# Altium schematic sheet CoG_CPT.SchDoc
size A3; Author: Audran; CompanyName: Goldorak; Address1: Electrolab; Address2: 52 rue Paul Lescop; Address3: 92000 Nanterre; ProjectName: Cartes_2017
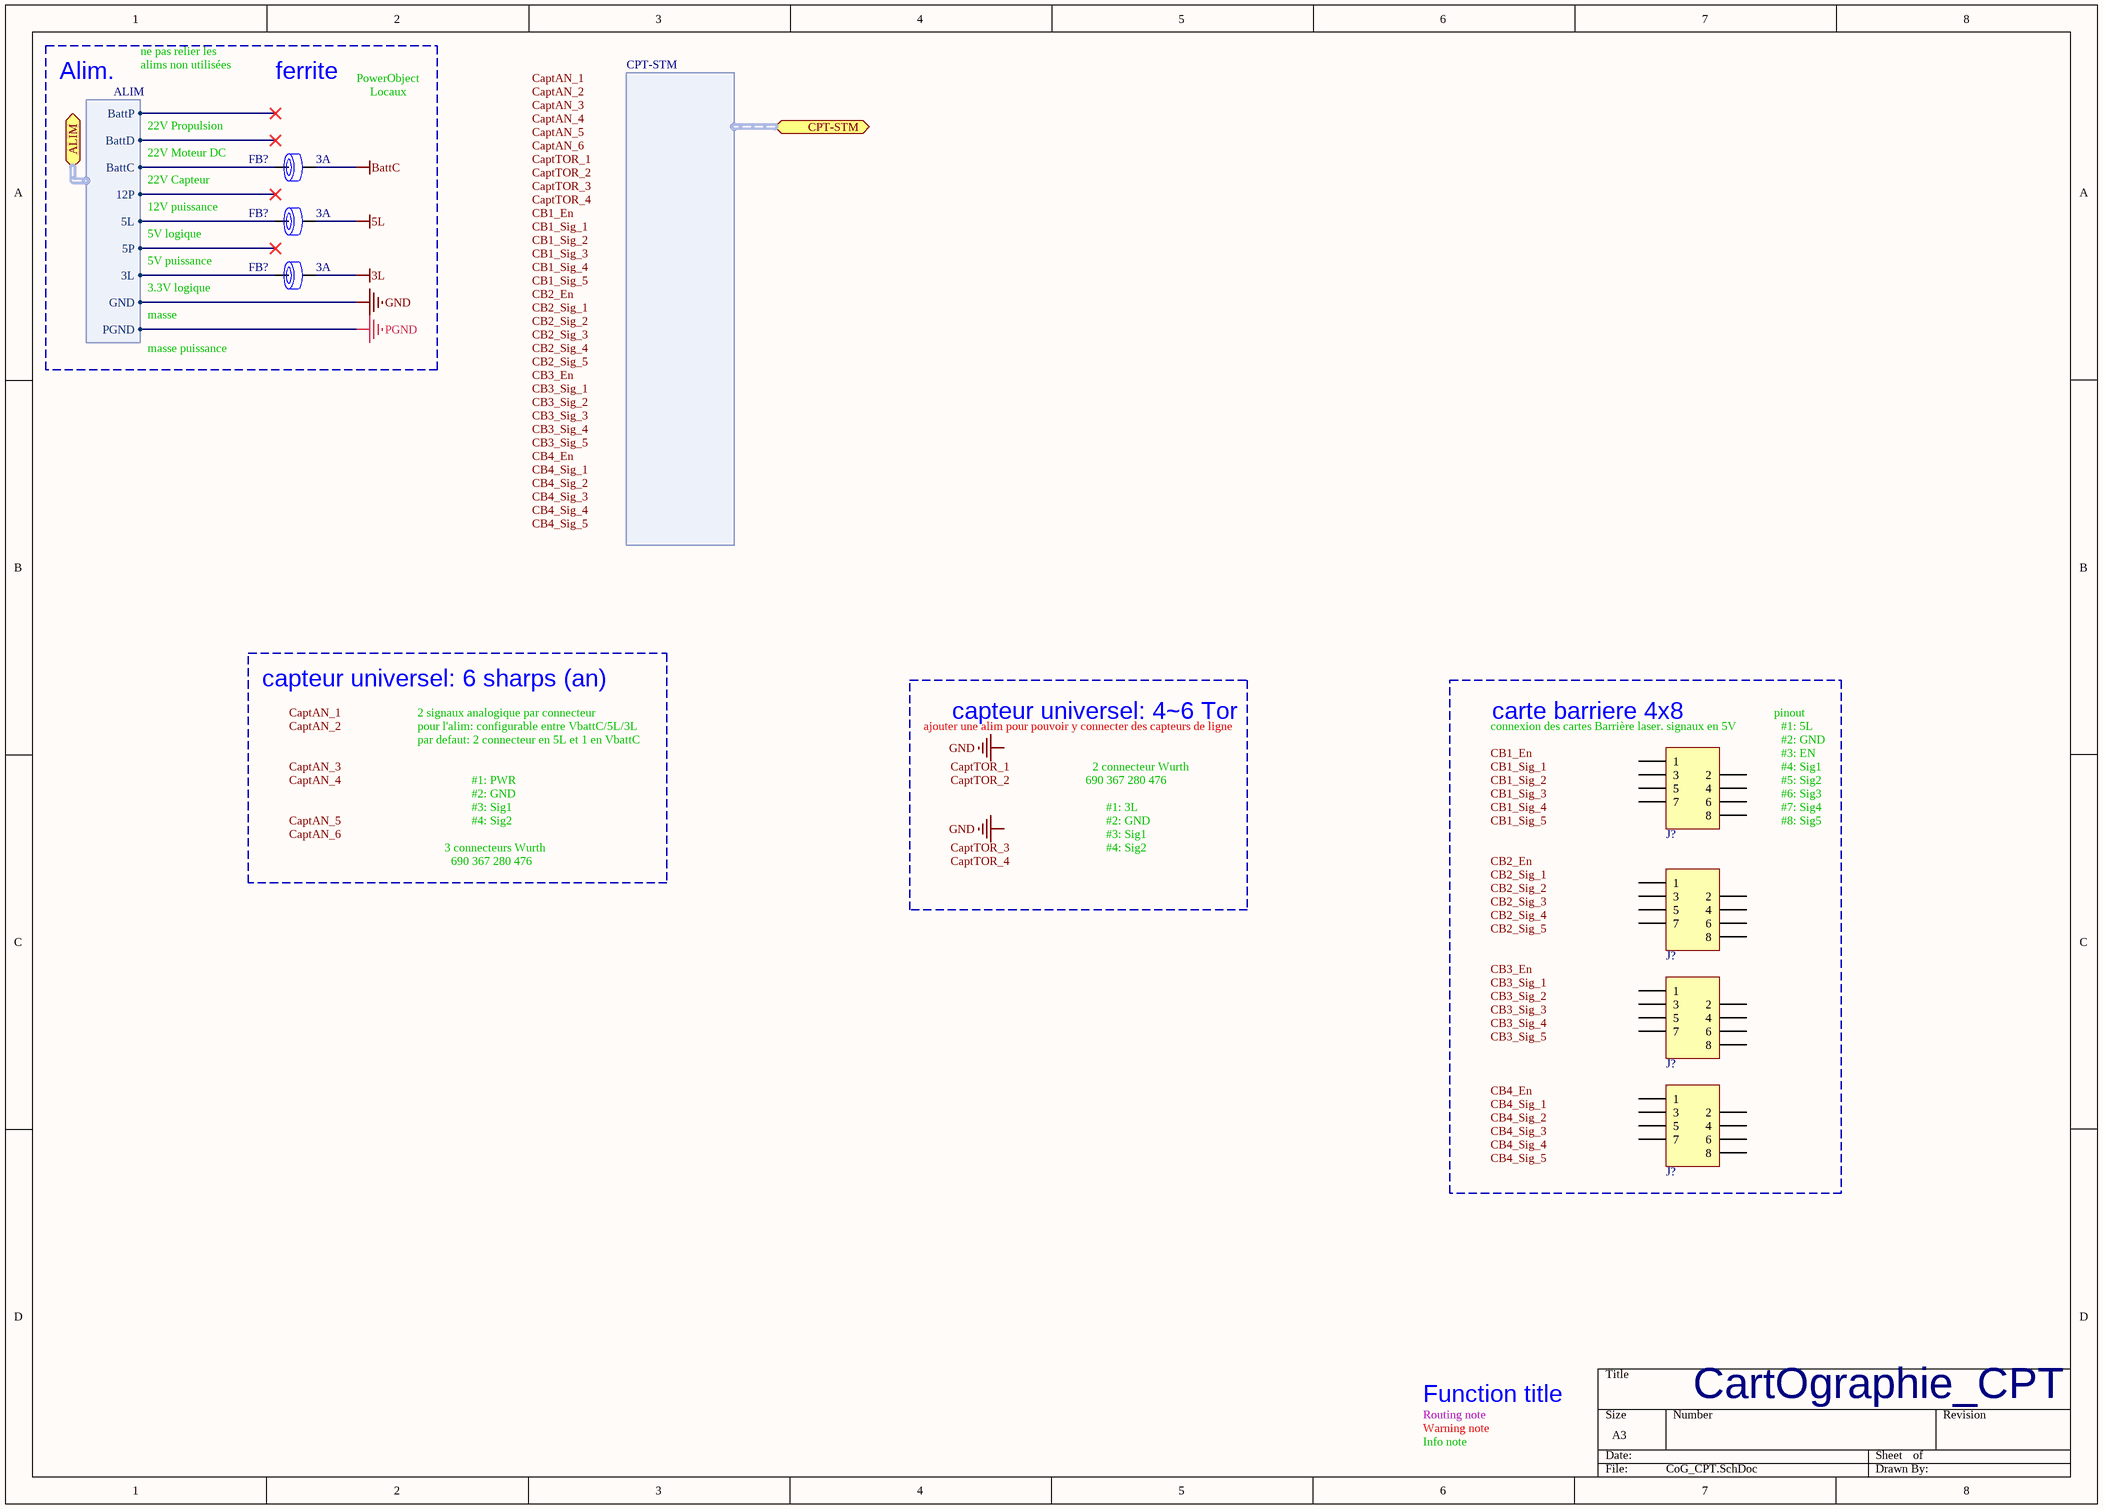
[diagram p0: CoG_CPT.SchDoc]

## Parts
(Parts that share a designator on the sheet are numbered #1, #2 ... from top to bottom, then left to right.)
FB?#1  RatedCurrent: 3A  [WE-CBF_0805_High Current]  (hidden comment: 742792023)
FB?#2  RatedCurrent: 3A  [WE-CBF_0805_High Current]  (hidden comment: 742792023)
FB?#3  RatedCurrent: 3A  [WE-CBF_0805_High Current]  (hidden comment: 742792023)
J?#1  (no value)  [690367280876]
J?#2  (no value)  [690367280876]
J?#3  (no value)  [690367280876]
J?#4  (no value)  [690367280876]

## Blocks framed on the sheet
carte barriere 4x8: J?#1-J?#4

## Ports
ALIM (harness ALIM), CPT-STM (harness CPT-STM)

## Harnesses
CPT-STM: 
ALIM: BattP, BattD, BattC, 12P, 5L, 5P, 3L, GND, PGND

## Nets
3L: FB?#3.2
5L: FB?#2.2
BattC: FB?#1.2
GND: port ALIM.GND
PGND: port ALIM.PGND
NetFB?#1_1: FB?#1.1 ; port ALIM.BattC
NetFB?#2_1: FB?#2.1 ; port ALIM.5L
NetFB?#3_1: FB?#3.1 ; port ALIM.3L

Not connected (* = marked no-connect by the designer): J?#1 1 2 3 4 5 6 7 8; J?#2 1 2 3 4 5 6 7 8; J?#3 1 2 3 4 5 6 7 8; J?#4 1 2 3 4 5 6 7 8

## Notes on the sheet
- Alim.
- ne pas relier les
- alims non utilisées
- ferrite
- PowerObject
- Locaux
- 22V Propulsion
- 22V Moteur DC
- 22V Capteur
- 5V logique
- 12V puissance
- 5V puissance
- 3.3V logique
- masse
- masse puissance
- capteur universel: 6 sharps (an)
- 2 signaux analogique par connecteur
- capteur universel: 4~6 Tor
- pinout
- pour l'alim: configurable entre VbattC/5L/3L
- par defaut: 2 connecteur en 5L et 1 en VbattC
- #1: PWR
- ajouter une alim pour pouvoir y connecter des capteurs de ligne
- 690 367 280 476
- 2 connecteur Wurth
- (near J?#1) connexion des cartes Barrière laser. signaux en 5V
- #1: 5L
- #2: GND
- #3: EN
- #4: Sig1
- #5: Sig2
- 3 connecteurs Wurth
- #3: Sig1
- #4: Sig2
- #1: 3L
- #6: Sig3
- #7: Sig4
- #8: Sig5
- Routing note
- Warning note
- Info note
- Function title
- CartOgraphie_CPT
- Labels drawn without touching a wire or pin: CaptAN_1, CaptAN_2, CaptAN_3, CaptAN_4, CaptAN_5, CaptAN_6, CaptTOR_1, CaptTOR_2, CaptTOR_3, CaptTOR_4, CB1_En, CB1_Sig_1, CB1_Sig_2, CB1_Sig_3, CB1_Sig_4, CB1_Sig_5, CB2_En, CB2_Sig_1, CB2_Sig_2, CB2_Sig_3, CB2_Sig_4, CB2_Sig_5, CB3_En, CB3_Sig_1, CB3_Sig_2, CB3_Sig_3, CB3_Sig_4, CB3_Sig_5, CB4_En, CB4_Sig_1, CB4_Sig_2, CB4_Sig_3, CB4_Sig_4, CB4_Sig_5, GND

## Library data of the parts
FB?#1-FB?#3 = WE-CBF, 742792023: Ferrite Bead 120ohm 0805 max3.0A; Manufacturer: Wurth Elektronik; Value: 120Ω; Type: High Current; PublishedDate: Aug 2016; ComponentLink1Description: Manufacturer; ComponentLink1URL: http://www.we-online.de; ComponentLink2Description: Datasheet; ComponentLink2URL: http://katalog.we-online.de/pbs/datasheet/742792023.pdf; Manufacturer Part Number: 742792023; Size: 0805
J?#1-J?#4 = 690367280876: WR-MM Female SMT Connector with Polarization; Manufacturer 1: W¨¹rth Elektronik eiSos GmbH; ComponentLink1 Description: Manufacturer; ComponentLink2 Description: Datasheet; Value: 8; Manufacturer Part Number: 690367280876; ComponentLink1URL: http://www.we-online.com; ComponentLink2URL: http://katalog.we-online.de/em/datasheet/69036728xx76.pdf; Supplier 1: Farnell; Supplier Part Number 1: 1641850